# Altium project SENSORS_SMALL.PrjPcb
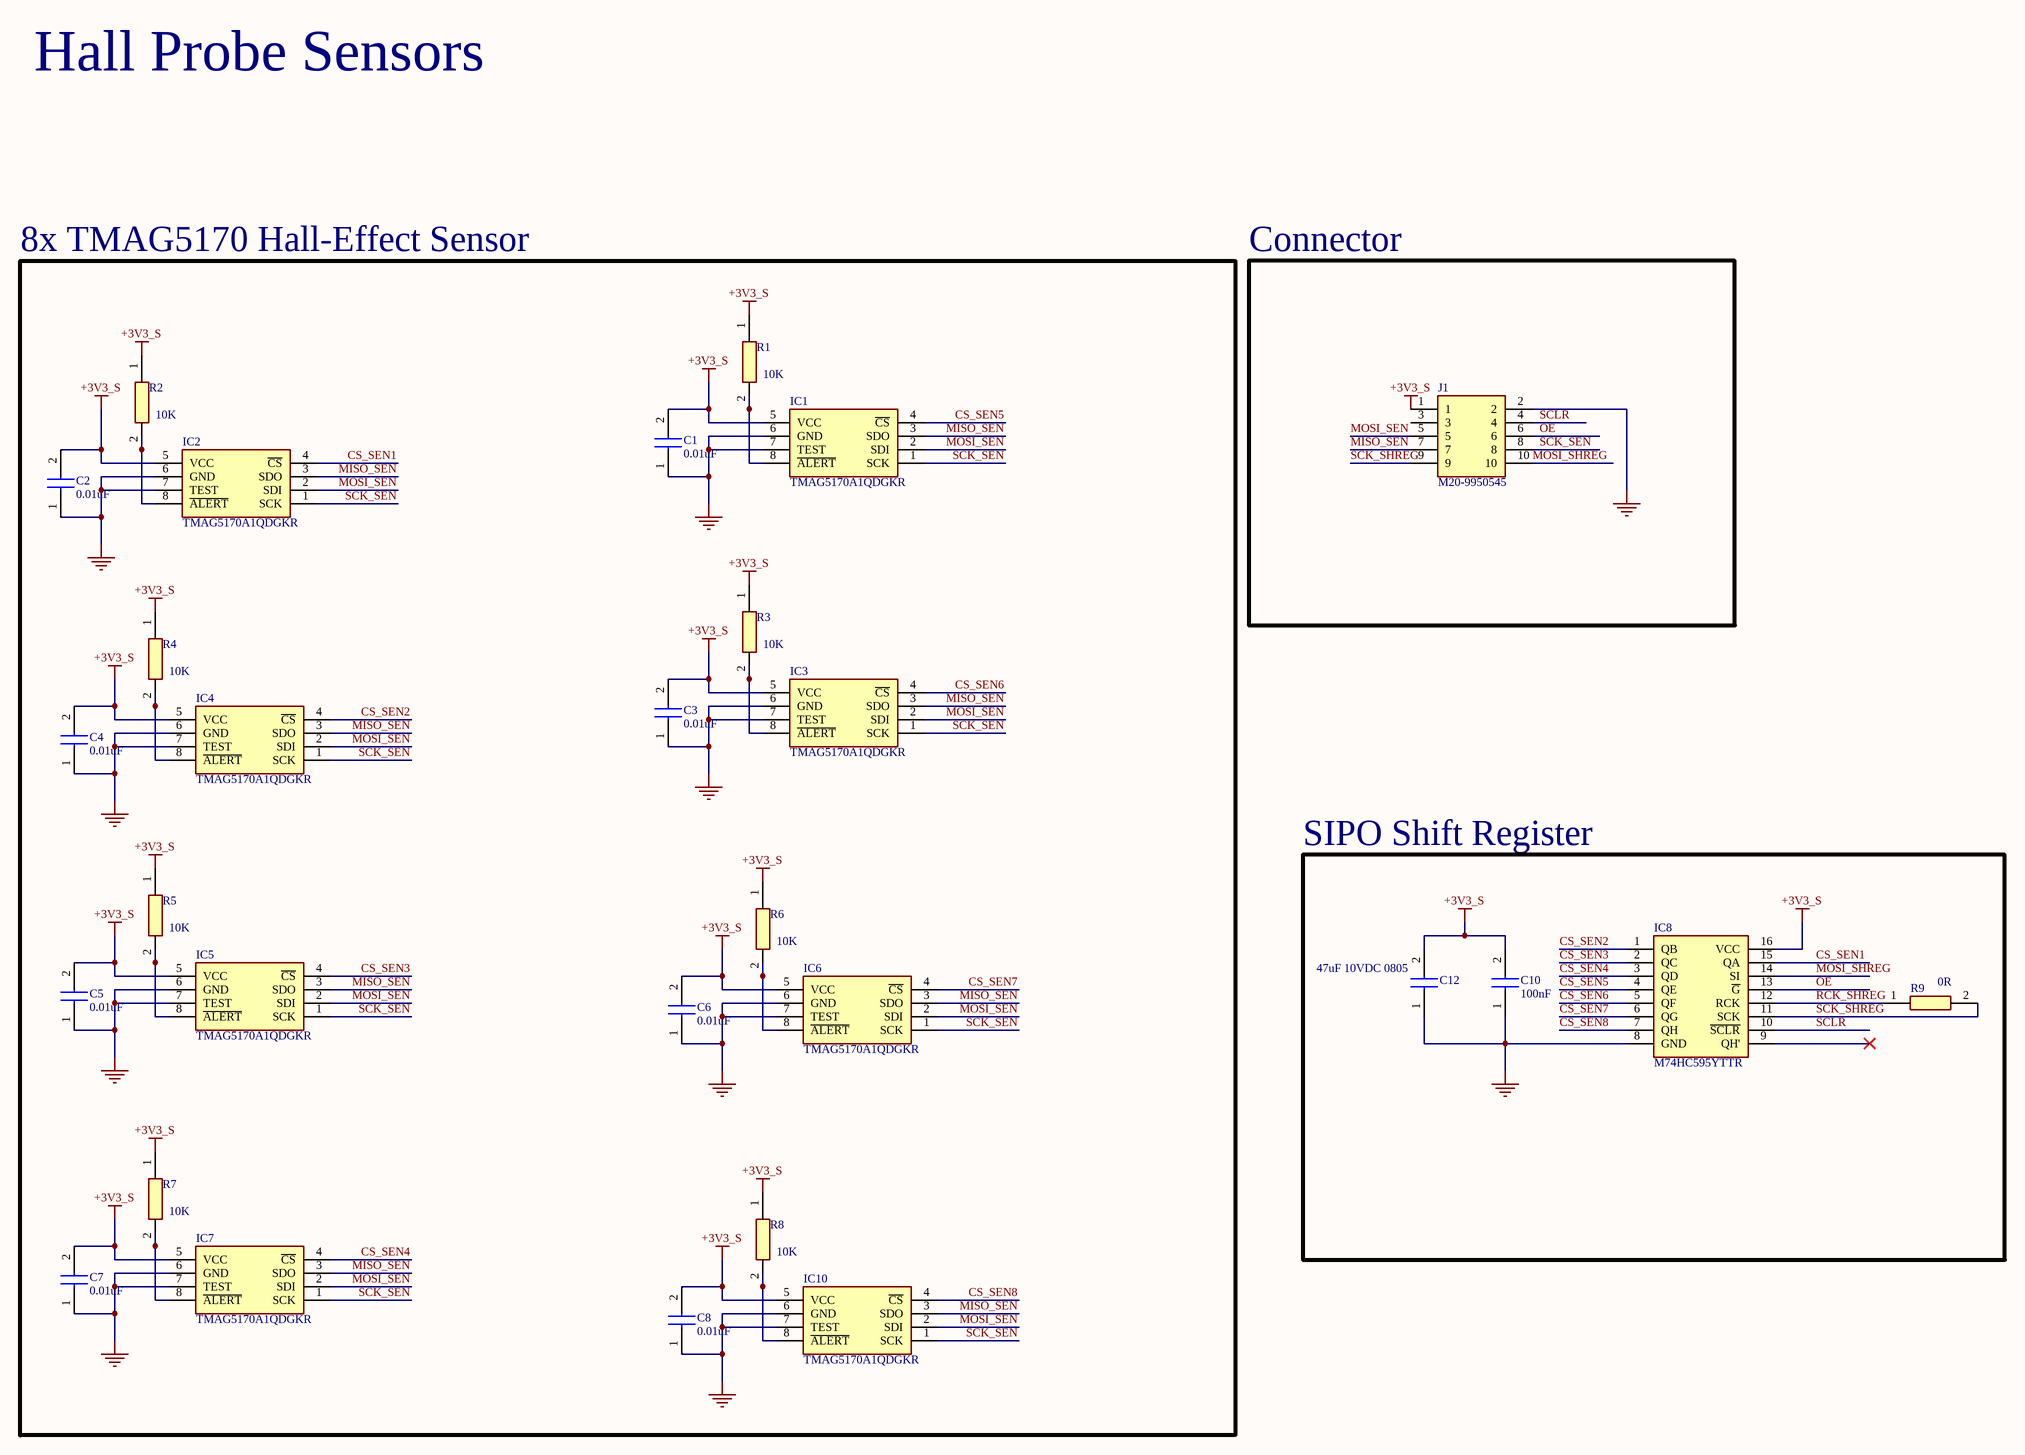
[diagram p0: SENSORS_SMALL_SCH.SchDoc]
1 sheet, 29 parts. Net scope: global (net labels, ports and power ports of the same name join across sheets).
Board file: SENSORS_SMALL_PCB.PcbDoc

## Sheet SENSORS_SMALL_SCH.SchDoc
size A2; SheetNumber: 1; SheetTotal: 1

### Parts
C1  0.01uF  [C0603]
C2  0.01uF  [C0603]
C3  0.01uF  [C0603]
C4  0.01uF  [C0603]
C5  0.01uF  [C0603]
C6  0.01uF  [C0603]
C7  0.01uF  [C0603]
C8  0.01uF  [C0603]
C10  100nF  [CAPC1608X95N]
C12  47uF 10VDC 0805  [CAPC2012X145N]
IC1  TMAG5170A1QDGKR  [SOP65P490X110-8N]
IC2  TMAG5170A1QDGKR  [SOP65P490X110-8N]
IC3  TMAG5170A1QDGKR  [SOP65P490X110-8N]
IC4  TMAG5170A1QDGKR  [SOP65P490X110-8N]
IC5  TMAG5170A1QDGKR  [SOP65P490X110-8N]
IC6  TMAG5170A1QDGKR  [SOP65P490X110-8N]
IC7  TMAG5170A1QDGKR  [SOP65P490X110-8N]
IC8  M74HC595YTTR  [SOP65P640X120-16N]
IC10  TMAG5170A1QDGKR  [SOP65P490X110-8N]
J1  M20-9950545  [HDRRA10W66P254_2X5_1270X254X528P]
R1  10K  [RESC1608X55N]
R2  10K  [RESC1608X55N]
R3  10K  [RESC1608X55N]
R4  10K  [RESC1608X55N]
R5  10K  [RESC1608X55N]
R6  10K  [RESC1608X55N]
R7  10K  [RESC1608X55N]
R8  10K  [RESC1608X55N]
R9  0R  [RESC1608X55N]

### Blocks framed on the sheet
8x TMAG5170 Hall-Effect Sensor: C1-C8 IC1-IC7 IC10 R1-R8
Connector: J1
SIPO Shift Register: C10 C12 IC8 R9

### Nets
+3V3_S: C1.2 C2.2 C3.2 C4.2 C5.2 C6.2 C7.2 C8.2 C10.2 C12.2 IC1.5(VCC) IC2.5(VCC) IC3.5(VCC) IC4.5(VCC) IC5.5(VCC) IC6.5(VCC) IC7.5(VCC) IC8.16(VCC) IC10.5(VCC) J1.1 R1.1 R2.1 R3.1 R4.1 R5.1 R6.1 R7.1 R8.1
GND: C1.1 C2.1 C3.1 C4.1 C5.1 C6.1 C7.1 C8.1 C10.1 C12.1 IC1.6(GND) IC1.7(TEST) IC2.6(GND) IC2.7(TEST) IC3.6(GND) IC3.7(TEST) IC4.6(GND) IC4.7(TEST) IC5.6(GND) IC5.7(TEST) IC6.6(GND) IC6.7(TEST) IC7.6(GND) IC7.7(TEST) IC8.8(GND) IC10.6(GND) IC10.7(TEST) J1.2
CS_SEN1: IC2.4(~{CS}) IC8.15(QA)
CS_SEN2: IC4.4(~{CS}) IC8.1(QB)
CS_SEN3: IC5.4(~{CS}) IC8.2(QC)
CS_SEN4: IC7.4(~{CS}) IC8.3(QD)
CS_SEN5: IC1.4(~{CS}) IC8.4(QE)
CS_SEN6: IC3.4(~{CS}) IC8.5(QF)
CS_SEN7: IC6.4(~{CS}) IC8.6(QG)
CS_SEN8: IC8.7(QH) IC10.4(~{CS})
MISO_SEN: IC1.3(SDO) IC2.3(SDO) IC3.3(SDO) IC4.3(SDO) IC5.3(SDO) IC6.3(SDO) IC7.3(SDO) IC10.3(SDO) J1.7
MOSI_SEN: IC1.2(SDI) IC2.2(SDI) IC3.2(SDI) IC4.2(SDI) IC5.2(SDI) IC6.2(SDI) IC7.2(SDI) IC10.2(SDI) J1.5
MOSI_SHREG: IC8.14(SI) J1.10
OE: IC8.13(~{G}) J1.6
RCK_SHREG: IC8.12(RCK) R9.1
SCK_SEN: IC1.1(SCK) IC2.1(SCK) IC3.1(SCK) IC4.1(SCK) IC5.1(SCK) IC6.1(SCK) IC7.1(SCK) IC10.1(SCK) J1.8
SCK_SHREG: IC8.11(SCK) J1.9 R9.2
SCLR: IC8.10(~{SCLR}) J1.4
NetIC1_8: IC1.8(~{ALERT}) R1.2
NetIC2_8: IC2.8(~{ALERT}) R2.2
NetIC3_8: IC3.8(~{ALERT}) R3.2
NetIC4_8: IC4.8(~{ALERT}) R4.2
NetIC5_8: IC5.8(~{ALERT}) R5.2
NetIC6_8: IC6.8(~{ALERT}) R6.2
NetIC7_8: IC7.8(~{ALERT}) R7.2
NetIC10_8: IC10.8(~{ALERT}) R8.2

Not connected (* = marked no-connect by the designer): IC8 9(QH')*; J1 3

### Notes on the sheet
- Hall Probe Sensors

### Library data of the parts
C1-C8 = C0603C103J4RACTU: Capacitor; Manufacturer_Name: KEMET; Datasheet Link: https://content.kemet.com/datasheets/KEM_C1002_X7R_SMD.pdf; Height: 0.87mm; Manufacturer_Part_Number: C0603C103J4RACTU; Mouser Part Number: 80-C0603C103J4R; Mouser Price/Stock: https://www.mouser.com/Search/Refine.aspx?Keyword=80-C0603C103J4R; Arrow Part Number: C0603C103J4RACTU; Arrow Price/Stock: https://www.arrow.com/en/products/c0603c103j4ractu/kemet-corporation
C10 = C0603C104J4RAC: Capacitor; Manufacturer_Name: KEMET; Datasheet Link: https://datasheet.datasheetarchive.com/originals/distributors/SFDatasheet-4/sf-00083930.pdf; Height: 0.95mm; Manufacturer_Part_Number: C0603C104J4RAC; Mouser Part Number: 80-C0603C104J4RAC; Mouser Price/Stock: https://www.mouser.co.uk/ProductDetail/KEMET/C0603C104J4RAC?qs=sykUljcfnH31MXmq5HGjkg%3D%3D; Arrow Part Number: C0603C104J4RAC; Arrow Price/Stock: https://www.arrow.com/en/products/c0603c104j4rac/kemet-corporation?region=nac
C12 = GRM21BR61A476ME15K: Capacitor; Manufacturer_Name: Murata Electronics; Datasheet Link: http://www.murata.com/~/media/webrenewal/support/library/catalog/products/capacitor/mlcc/c02e.pdf; Height: 1.45mm; Manufacturer_Part_Number: GRM21BR61A476ME15K; Mouser Part Number: 81-GRM21BR61A476ME5K; Mouser Price/Stock: https://www.mouser.co.uk/ProductDetail/Murata-Electronics/GRM21BR61A476ME15K?qs=hNud%2FORuBR153XPtoO6XtA%3D%3D; Arrow Part Number: GRM21BR61A476ME15K; Arrow Price/Stock: https://www.arrow.com/en/products/grm21br61a476me15k/murata-manufacturing?region=nac
IC1-IC7 IC10 = TMAG5170A1QDGKR: Integrated Circuit; Manufacturer_Name: Texas Instruments; Datasheet Link: https://www.ti.com/lit/ds/symlink/tmag5170.pdf?ts=1631468164599&ref_url=https%253A%252F%252Fwww.ti.com%252Fsitesearch%252Fdocs%252Funiversalsearch.tsp%253FlangPref%253Den-US%2526searchTerm%253DTMAG5170A1QDGKR%2526nr%253D4; Height: 1.1mm; Manufacturer_Part_Number: TMAG5170A1QDGKR; Mouser Part Number: 595-TMAG5170A1QDGKR; Mouser Price/Stock: https://www.mouser.co.uk/ProductDetail/Texas-Instruments/TMAG5170A1QDGKR?qs=7D1LtPJG0i2KumggWL5Glw%3D%3D; Arrow Part Number: TMAG5170A1QDGKR; Arrow Price/Stock: https://www.arrow.com/en/products/tmag5170a1qdgkr/texas-instruments?region=nac
IC8 = M74HC595YTTR: Integrated Circuit; Manufacturer_Name: STMicroelectronics; Datasheet Link: https://componentsearchengine.com/Datasheets/1/M74HC595YTTR.pdf; Height: 1.2mm; Manufacturer_Part_Number: M74HC595YTTR; Mouser Part Number: 511-M74HC595YTTR; Mouser Price/Stock: https://www.mouser.co.uk/ProductDetail/STMicroelectronics/M74HC595YTTR?qs=WHlX%252B%252B9%2FRwCpo6YE5YKRQQ%3D%3D; Arrow Part Number: M74HC595YTTR; Arrow Price/Stock: https://www.arrow.com/en/products/m74hc595yttr/stmicroelectronics
J1 = M20-9950545: Connector; Manufacturer_Name: Harwin; Datasheet Link: https://cdn.harwin.com/pdfs/M20-995.pdf; Height: 5.28mm; Manufacturer_Part_Number: M20-9950545; Mouser Part Number: 855-M20-9950545; Mouser Price/Stock: https://www.mouser.com/Search/Refine.aspx?Keyword=855-M20-9950545
R1-R9 = RK73B1JTTD103J: Resistor; Manufacturer_Name: KOA Speer; Datasheet Link: http://www.koaspeer.com/catimages/Products/RK73-RT/RK73-RT.pdf; Height: 0.55mm; Manufacturer_Part_Number: RK73B1JTTD103J; Mouser Part Number: 660-RK73B1JTTD103J; Mouser Price/Stock: https://www.mouser.co.uk/ProductDetail/KOA-Speer/RK73B1JTTD103J?qs=hmtrJ2UjXcBKRTcwO9LloQ%3D%3D; Arrow Part Number: RK73B1JTTD103J; Arrow Price/Stock: https://www.arrow.com/en/products/rk73b1jttd103j/koa-speer-electronics?region=asia